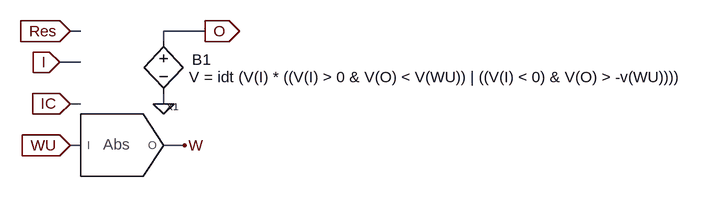
[diagram p0: schematic integrator_WU_module.asc]
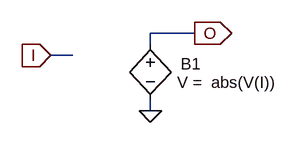
[diagram p1: sub-circuit abs_module.asc]
integrator_WU_module.asc, the LTspice schematic file:
Version 4
SHEET 1 880 680
WIRE 128 160 112 160
WIRE 320 160 256 160
WIRE 256 176 256 160
WIRE 128 208 96 208
WIRE 128 272 112 272
WIRE 256 272 256 256
WIRE 128 336 112 336
WIRE 288 336 256 336
FLAG 96 208 I
IOPIN 96 208 In
FLAG 256 272 0
FLAG 320 160 O
IOPIN 320 160 Out
FLAG 112 272 IC
IOPIN 112 272 In
FLAG 112 160 Res
IOPIN 112 160 In
FLAG 112 336 WU
IOPIN 112 336 In
FLAG 288 336 W
SYMBOL bv 256 160 R0
WINDOW 0 44 44 Left 0
WINDOW 3 39 71 Left 0
SYMATTR InstName B1
SYMATTR Value V = idt (V(I) * ((V(I) > 0 & V(O) < V(WU)) | ((V(I) < 0) & V(O) > -v(WU))))
SYMBOL abs_module 224 320 R0
SYMATTR InstName X1

abs_module.asc, the sub-circuit schematic file:
Version 4
SHEET 1 880 680
WIRE 240 160 176 160
WIRE 176 176 176 160
WIRE 64 192 32 192
WIRE 176 272 176 256
FLAG 32 192 I
IOPIN 32 192 In
FLAG 176 272 0
FLAG 240 160 O
IOPIN 240 160 Out
SYMBOL bv 176 160 R0
WINDOW 0 44 44 Left 0
WINDOW 3 39 71 Left 0
SYMATTR InstName B1
SYMATTR Value V =  abs(V(I))

The netlist it stands for:
* integrator_WU_module.asc
B1 O 0 V = idt (V(I) * ((V(I) > 0 & V(O) < V(WU)) | ((V(I) < 0) & V(O) > -v(WU))))
XX1 W WU abs_module

* block symbol definitions
.subckt abs_module O I
B1 O 0 V =  abs(V(I))
.ends abs_module

.backanno
.end